# Altium project FPGA_DB.PrjPcb
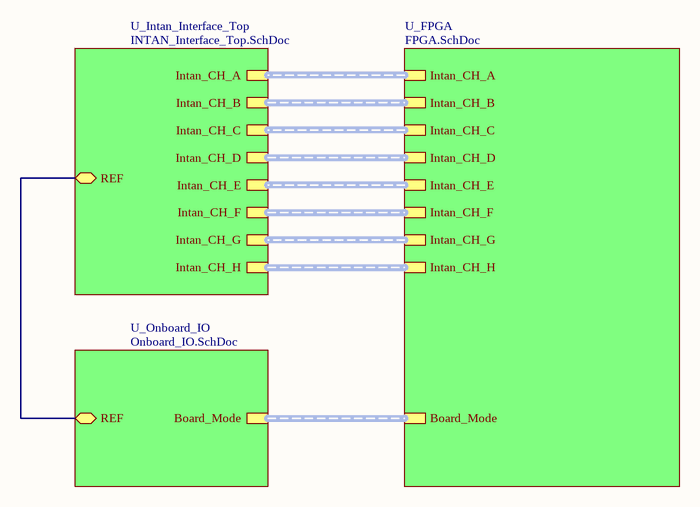
[diagram p0: Title_Page.SchDoc]
Project_Date: 2026-09-01; Project_DateCode: DC260901; Project_Designer1: Olivier Bergeron; Project_Designer2: Quentin Mascret; Project_Designer3: Benoit Gosselin; Project_Global: UHDEMG; Project_Group: SBioML; Project_Name: FPGA Daughter Board; Project_Revision: 2.000; Project_Stencil_Bot_Thickness: 0.1 MM; Project_Stencil_Top_Thickness: 0.1 MM
5 sheets, 140 parts. Net scope: hierarchical (ports join the sheet entries above them; power ports are global).
Board file: FPGA_DB.PcbDoc
Sheets:
  Title_Page.SchDoc
    U_FPGA = FPGA.SchDoc
    U_Onboard_IO = Onboard_IO.SchDoc
    U_Intan_Interface_Top = INTAN_Interface_Top.SchDoc
      A = INTAN_Interface.SchDoc
      B = INTAN_Interface.SchDoc
      C = INTAN_Interface.SchDoc
      D = INTAN_Interface.SchDoc
      E = INTAN_Interface.SchDoc
      F = INTAN_Interface.SchDoc
      G = INTAN_Interface.SchDoc
      H = INTAN_Interface.SchDoc

## Sheet Title_Page.SchDoc
size Tabloid; SheetNumber: 1; SheetTotal: 5; Sheet_Name: Title Page; Size: 11x17

### Sub-sheets
U_FPGA = FPGA.SchDoc: Board_Mode (harness Board_Mode), Intan_CH_A (harness Intan_CH), Intan_CH_B (harness Intan_CH), Intan_CH_C (harness Intan_CH), Intan_CH_D (harness Intan_CH), Intan_CH_E (harness Intan_CH), Intan_CH_F (harness Intan_CH), Intan_CH_G (harness Intan_CH), Intan_CH_H (harness Intan_CH)
U_Intan_Interface_Top = INTAN_Interface_Top.SchDoc: Intan_CH_A (harness Intan_CH), Intan_CH_B (harness Intan_CH), Intan_CH_C (harness Intan_CH), Intan_CH_D (harness Intan_CH), Intan_CH_E (harness Intan_CH), Intan_CH_F (harness Intan_CH), Intan_CH_G (harness Intan_CH), Intan_CH_H (harness Intan_CH), REF (bidir)
U_Onboard_IO = Onboard_IO.SchDoc: Board_Mode (harness Board_Mode), REF (bidir)

### Nets
REF: sheet U_Onboard_IO/REF, sheet U_Intan_Interface_Top/REF

### Buses and harness runs
harness sheet U_FPGA/Board_Mode = sheet U_Onboard_IO/Board_Mode
harness sheet U_FPGA/Intan_CH_A = sheet U_Intan_Interface_Top/Intan_CH_A
harness sheet U_FPGA/Intan_CH_B = sheet U_Intan_Interface_Top/Intan_CH_B
harness sheet U_FPGA/Intan_CH_C = sheet U_Intan_Interface_Top/Intan_CH_C
harness sheet U_FPGA/Intan_CH_D = sheet U_Intan_Interface_Top/Intan_CH_D
harness sheet U_FPGA/Intan_CH_E = sheet U_Intan_Interface_Top/Intan_CH_E
harness sheet U_FPGA/Intan_CH_F = sheet U_Intan_Interface_Top/Intan_CH_F
harness sheet U_FPGA/Intan_CH_G = sheet U_Intan_Interface_Top/Intan_CH_G
harness sheet U_FPGA/Intan_CH_H = sheet U_Intan_Interface_Top/Intan_CH_H

### Notes on the sheet
- Sheet Name
- Project Title
- Global Project
- Size
- Group
- Revision
- Date
- Sheet
- of
- Filename
- Designers

## Sheet FPGA.SchDoc
size Tabloid; SheetNumber: 2; SheetTotal: 5; Sheet_Name: FPGA; Size: 11x17
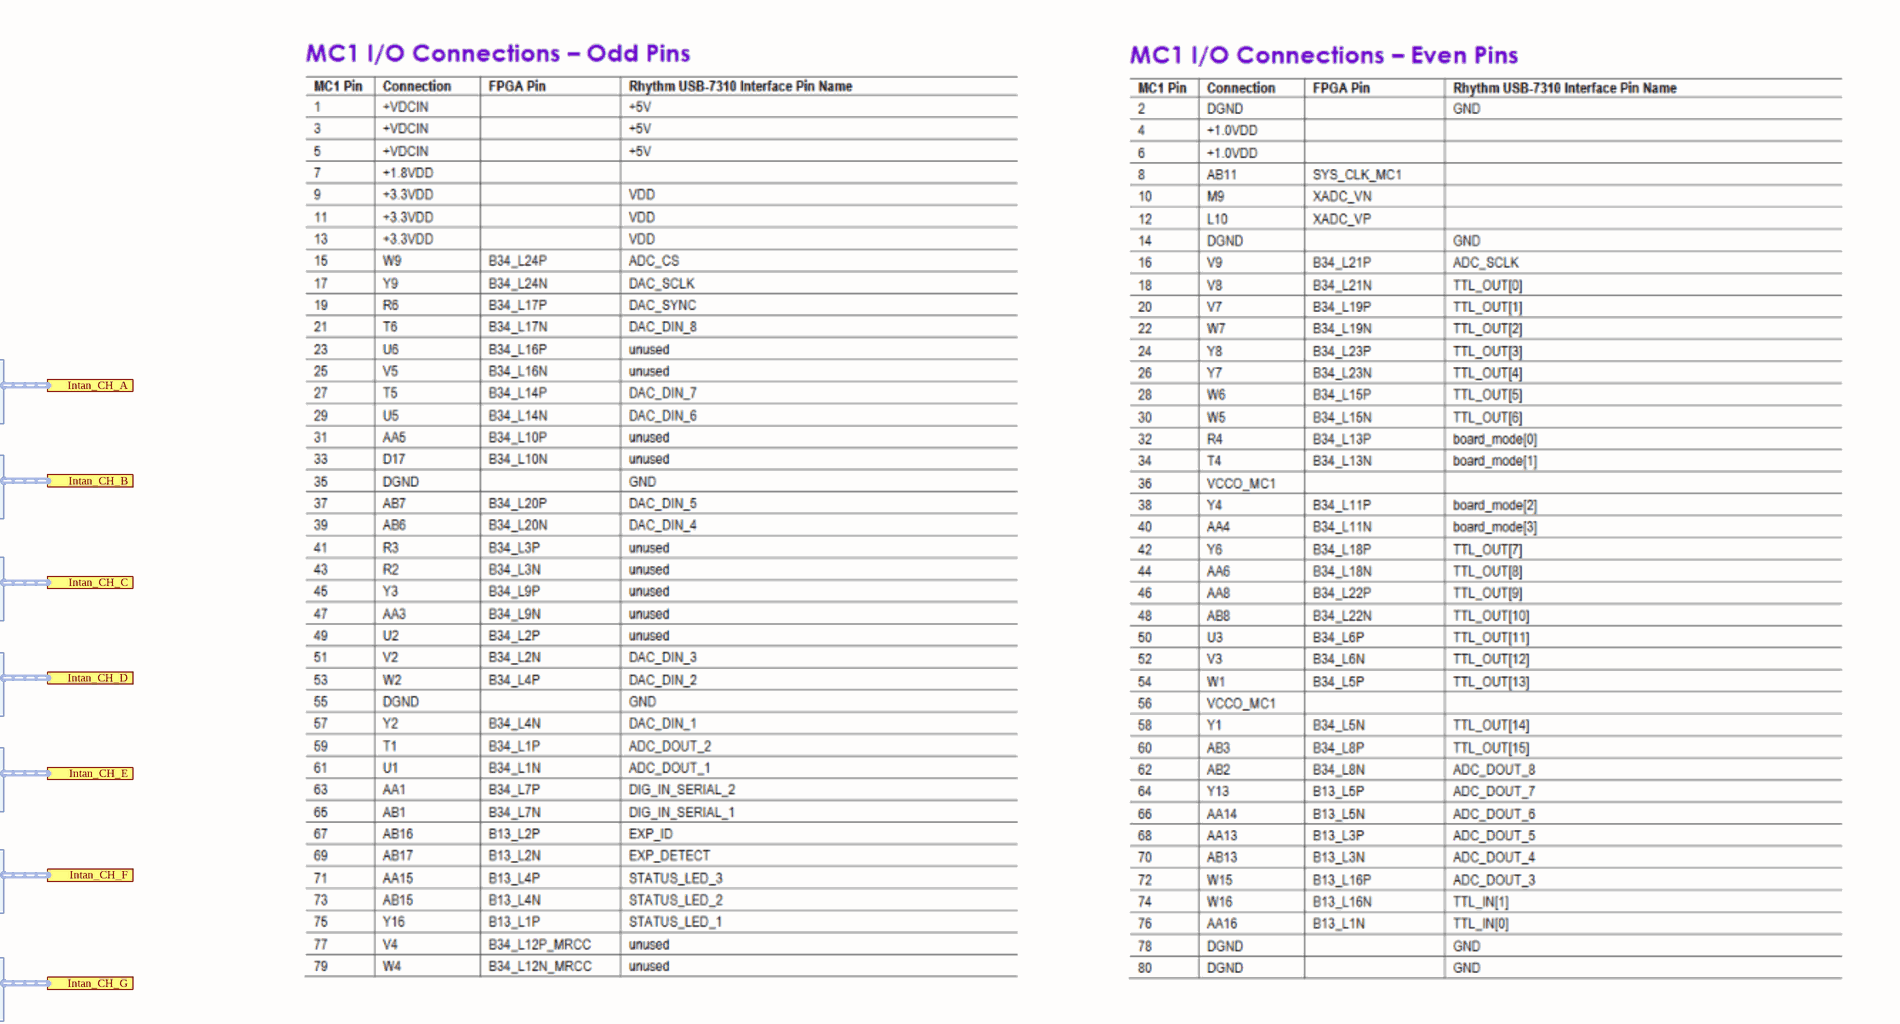
[diagram p1: FPGA.SchDoc, top right]
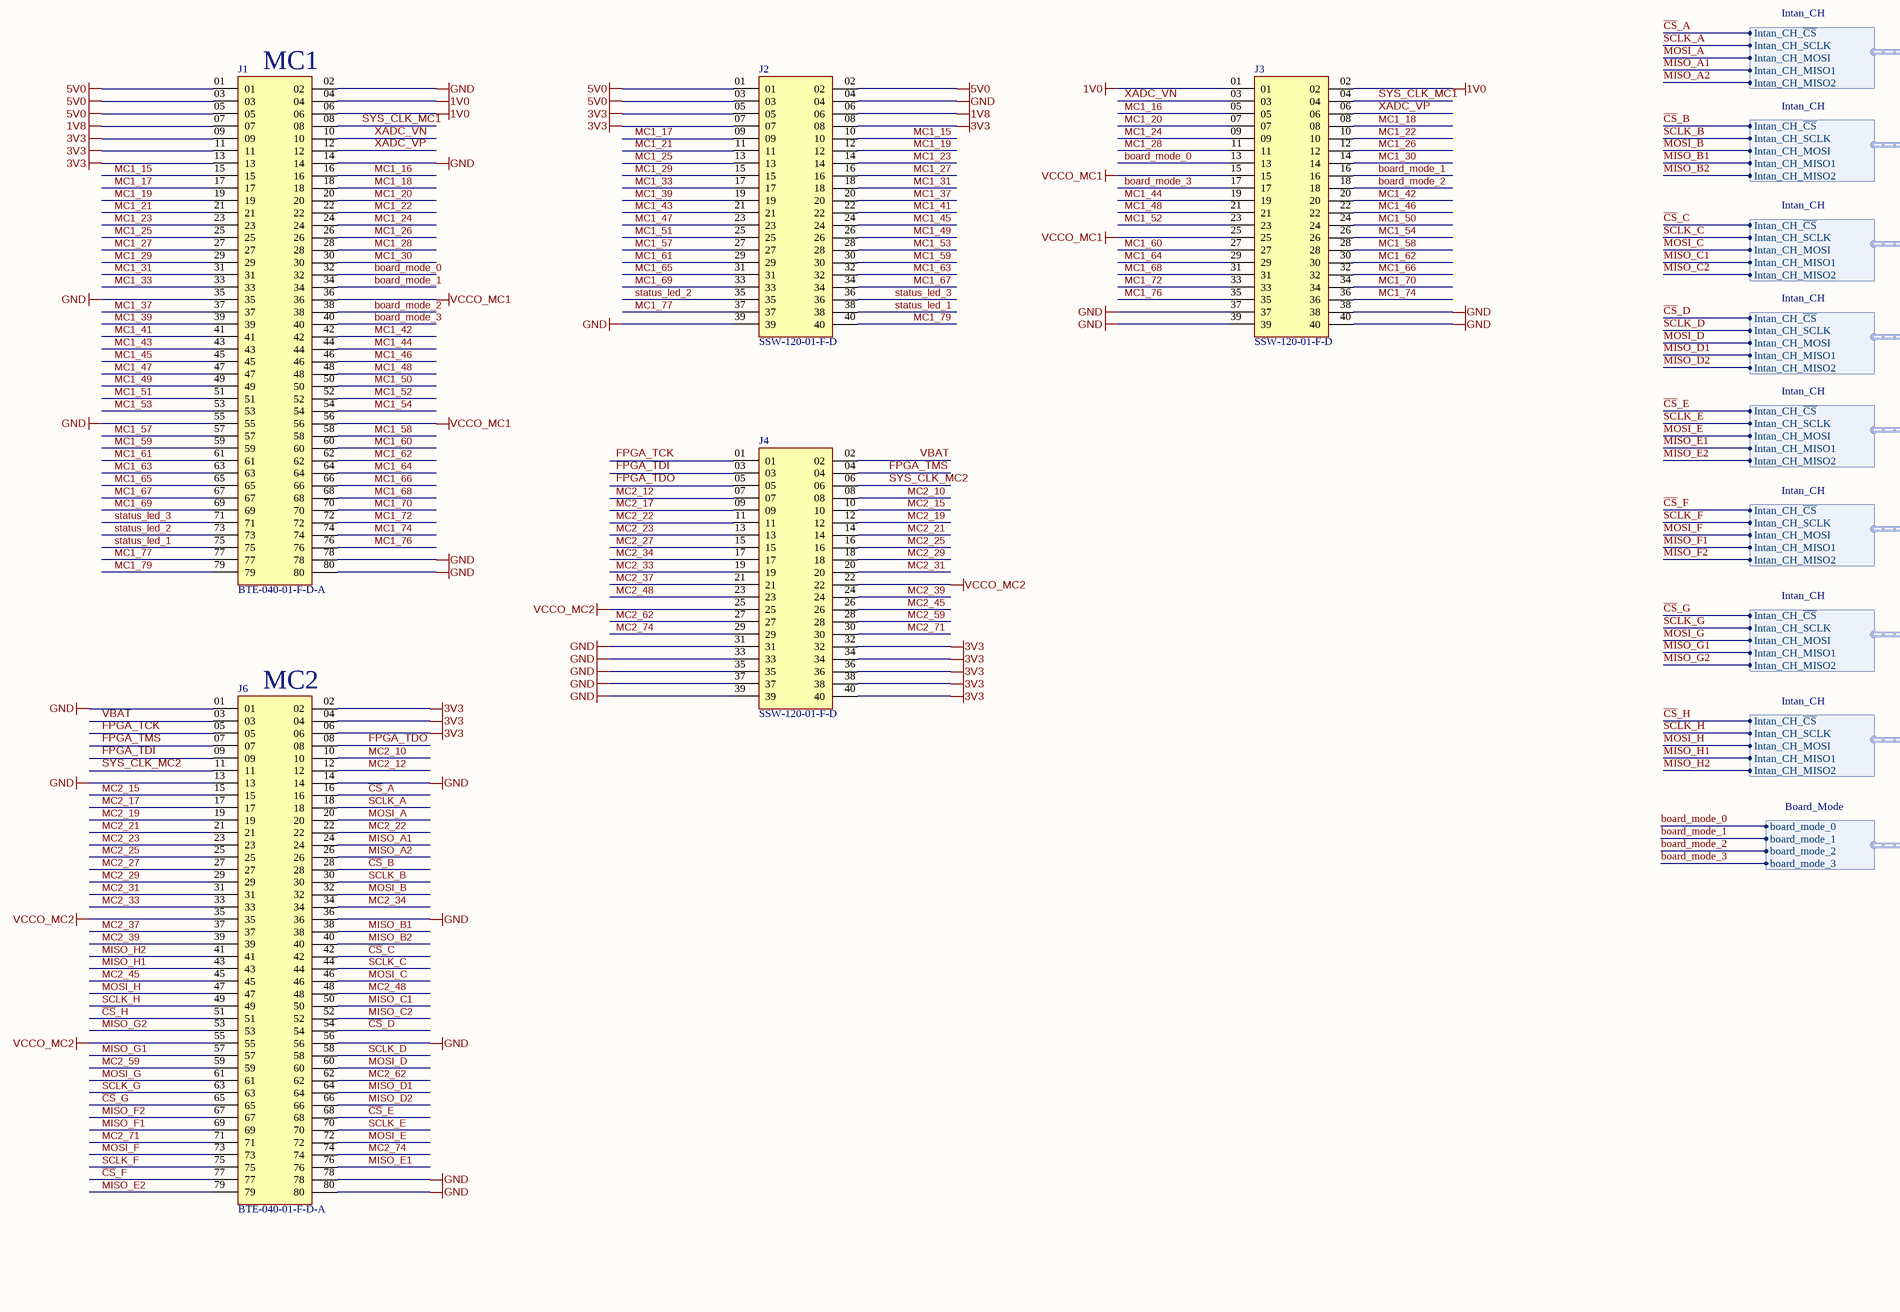
[diagram p2: FPGA.SchDoc, bottom left]
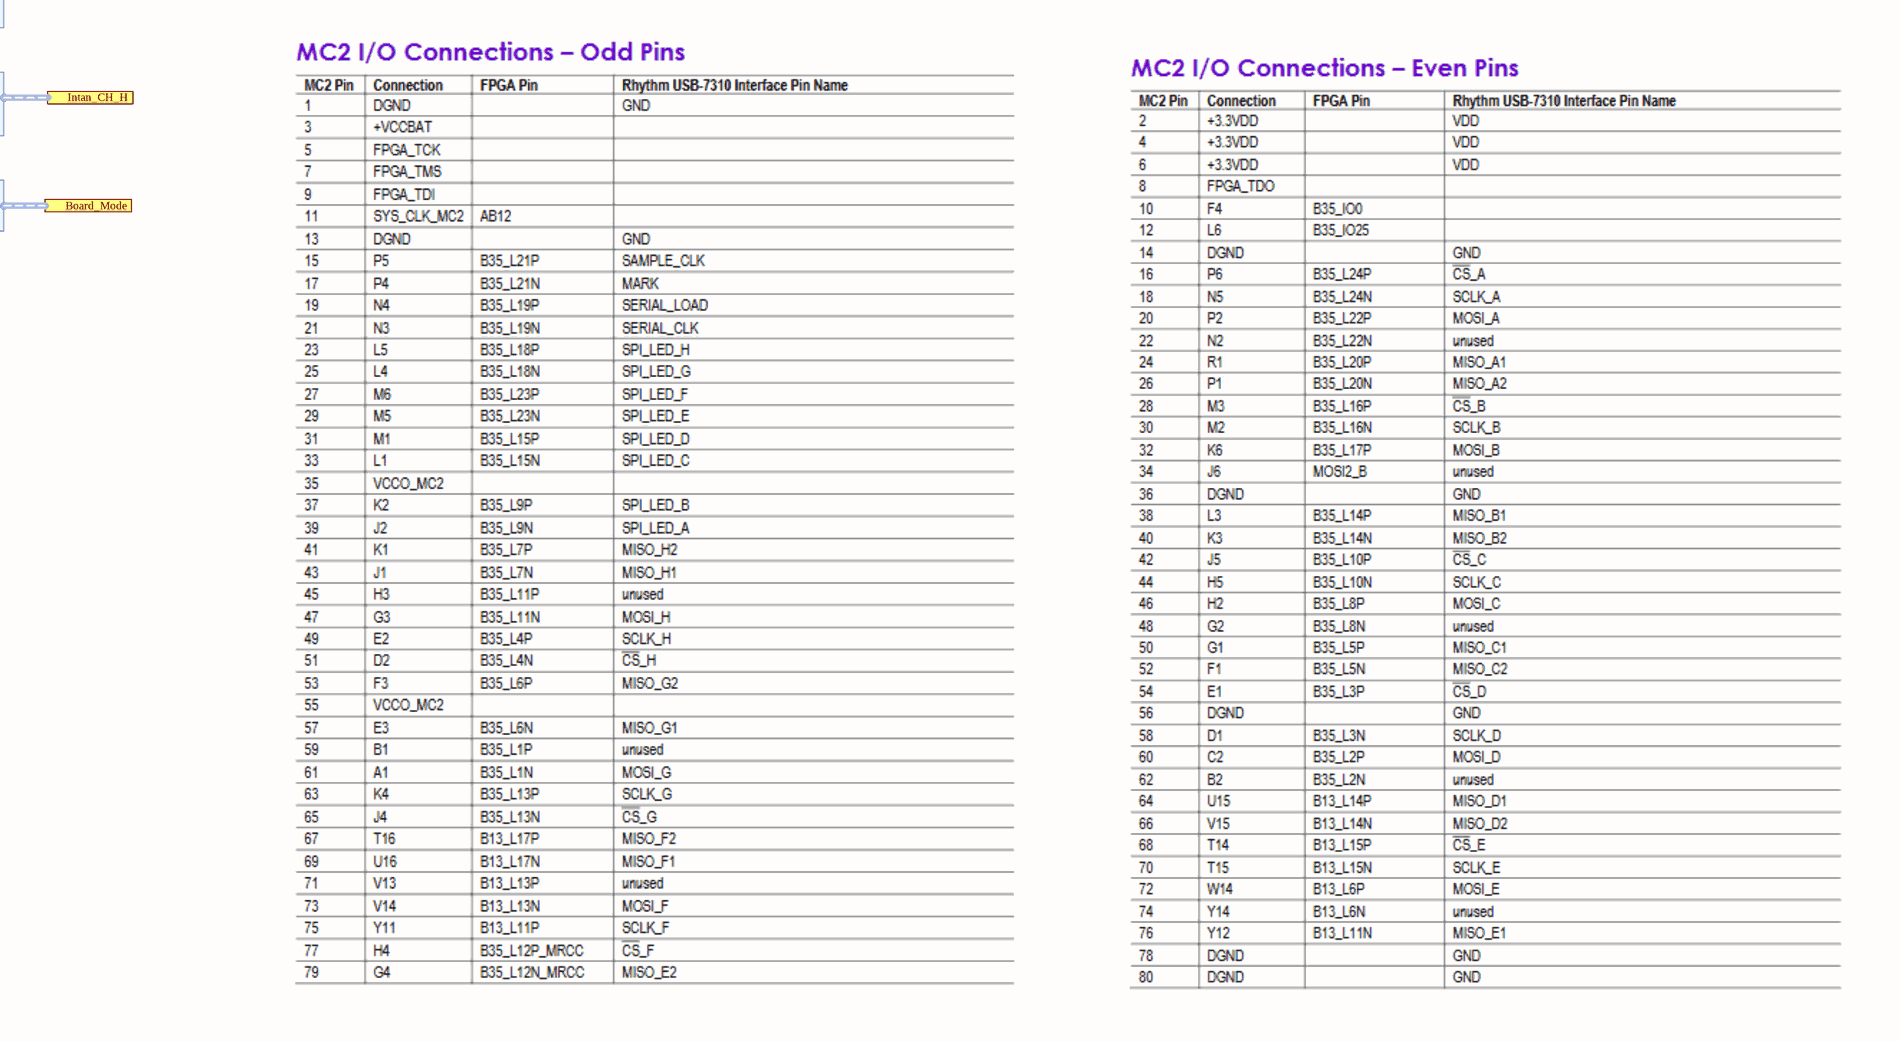
[diagram p3: FPGA.SchDoc, bottom right]

### Parts
J1  BTE-040-01-F-D-A  [SAMTEC_BTE-040-01-F-D-A]
J2  SSW-120-01-F-D  [SAMTEC_SSW-120-01-F-D]
J3  SSW-120-01-F-D  [SAMTEC_SSW-120-01-F-D]
J4  SSW-120-01-F-D  [SAMTEC_SSW-120-01-F-D]
J6  BTE-040-01-F-D-A  [SAMTEC_BTE-040-01-F-D-A]

### Ports
Board_Mode (harness Board_Mode), Intan_CH_A (harness Intan_CH), Intan_CH_B (harness Intan_CH), Intan_CH_C (harness Intan_CH), Intan_CH_D (harness Intan_CH), Intan_CH_E (harness Intan_CH), Intan_CH_F (harness Intan_CH), Intan_CH_G (harness Intan_CH), Intan_CH_H (harness Intan_CH)

### Harnesses
Board_Mode: board_mode_0, board_mode_1, board_mode_2, board_mode_3
Intan_CH: Intan_CH_~{CS}, Intan_CH_SCLK, Intan_CH_MOSI, Intan_CH_MISO1, Intan_CH_MISO2

### Nets
1V0: J1.04 J1.06 J3.01 J3.02
1V8: J1.07 J2.06
3V3: J1.09 J1.11 J1.13 J2.05 J2.07 J2.08 J4.32 J4.34 J4.36 J4.38 J4.40 J6.02 J6.04 J6.06
5V0: J1.01 J1.03 J1.05 J2.01 J2.02 J2.03
GND: J1.02 J1.14 J1.35 J1.55 J1.78 J1.80 J2.04 J2.39 J3.37 J3.38 J3.39 J3.40 J4.31 J4.33 J4.35 J4.37 J4.39 J6.01 J6.13 J6.14 J6.36 J6.56 J6.78 J6.80
VCCO_MC1: J1.36 J1.56 J3.15 J3.25
VCCO_MC2: J4.22 J4.25 J6.35 J6.55
board_mode_0: J1.32 J3.13 ; port Board_Mode.board_mode_0
board_mode_1: J1.34 J3.16 ; port Board_Mode.board_mode_1
board_mode_2: J1.38 J3.18 ; port Board_Mode.board_mode_2
board_mode_3: J1.40 J3.17 ; port Board_Mode.board_mode_3
~{CS}_A: J6.16 ; port Intan_CH_A.Intan_CH_~{CS}
~{CS}_B: J6.28 ; port Intan_CH_B.Intan_CH_~{CS}
~{CS}_C: J6.42 ; port Intan_CH_C.Intan_CH_~{CS}
~{CS}_D: J6.54 ; port Intan_CH_D.Intan_CH_~{CS}
~{CS}_E: J6.68 ; port Intan_CH_E.Intan_CH_~{CS}
~{CS}_F: J6.77 ; port Intan_CH_F.Intan_CH_~{CS}
~{CS}_G: J6.65 ; port Intan_CH_G.Intan_CH_~{CS}
~{CS}_H: J6.51 ; port Intan_CH_H.Intan_CH_~{CS}
FPGA_TCK: J4.01 J6.05
FPGA_TDI: J4.03 J6.09
FPGA_TDO: J4.05 J6.08
FPGA_TMS: J4.04 J6.07
MC1_15: J1.15 J2.10
MC1_16: J1.16 J3.05
MC1_17: J1.17 J2.09
MC1_18: J1.18 J3.08
MC1_19: J1.19 J2.12
MC1_20: J1.20 J3.07
MC1_21: J1.21 J2.11
MC1_22: J1.22 J3.10
MC1_23: J1.23 J2.14
MC1_24: J1.24 J3.09
MC1_25: J1.25 J2.13
MC1_26: J1.26 J3.12
MC1_27: J1.27 J2.16
MC1_28: J1.28 J3.11
MC1_29: J1.29 J2.15
MC1_30: J1.30 J3.14
MC1_31: J1.31 J2.18
MC1_33: J1.33 J2.17
MC1_37: J1.37 J2.20
MC1_39: J1.39 J2.19
MC1_41: J1.41 J2.22
MC1_42: J1.42 J3.20
MC1_43: J1.43 J2.21
MC1_44: J1.44 J3.19
MC1_45: J1.45 J2.24
MC1_46: J1.46 J3.22
MC1_47: J1.47 J2.23
MC1_48: J1.48 J3.21
MC1_49: J1.49 J2.26
MC1_50: J1.50 J3.24
MC1_51: J1.51 J2.25
MC1_52: J1.52 J3.23
MC1_53: J1.53 J2.28
MC1_54: J1.54 J3.26
MC1_57: J1.57 J2.27
MC1_58: J1.58 J3.28
MC1_59: J1.59 J2.30
MC1_60: J1.60 J3.27
MC1_61: J1.61 J2.29
MC1_62: J1.62 J3.30
MC1_63: J1.63 J2.32
MC1_64: J1.64 J3.29
MC1_65: J1.65 J2.31
MC1_66: J1.66 J3.32
MC1_67: J1.67 J2.34
MC1_68: J1.68 J3.31
MC1_69: J1.69 J2.33
MC1_70: J1.70 J3.34
MC1_72: J1.72 J3.33
MC1_74: J1.74 J3.36
MC1_76: J1.76 J3.35
MC1_77: J1.77 J2.37
MC1_79: J1.79 J2.40
MC2_10: J4.08 J6.10
MC2_12: J4.07 J6.12
MC2_15: J4.10 J6.15
MC2_17: J4.09 J6.17
MC2_19: J4.12 J6.19
MC2_21: J4.14 J6.21
MC2_22: J4.11 J6.22
MC2_23: J4.13 J6.23
MC2_25: J4.16 J6.25
MC2_27: J4.15 J6.27
MC2_29: J4.18 J6.29
MC2_31: J4.20 J6.31
MC2_33: J4.19 J6.33
MC2_34: J4.17 J6.34
MC2_37: J4.21 J6.37
MC2_39: J4.24 J6.39
MC2_45: J4.26 J6.45
MC2_48: J4.23 J6.48
MC2_59: J4.28 J6.59
MC2_62: J4.27 J6.62
MC2_71: J4.30 J6.71
MC2_74: J4.29 J6.74
MISO_A1: J6.24 ; port Intan_CH_A.Intan_CH_MISO1
MISO_A2: J6.26 ; port Intan_CH_A.Intan_CH_MISO2
MISO_B1: J6.38 ; port Intan_CH_B.Intan_CH_MISO1
MISO_B2: J6.40 ; port Intan_CH_B.Intan_CH_MISO2
MISO_C1: J6.50 ; port Intan_CH_C.Intan_CH_MISO1
MISO_C2: J6.52 ; port Intan_CH_C.Intan_CH_MISO2
MISO_D1: J6.64 ; port Intan_CH_D.Intan_CH_MISO1
MISO_D2: J6.66 ; port Intan_CH_D.Intan_CH_MISO2
MISO_E1: J6.76 ; port Intan_CH_E.Intan_CH_MISO1
MISO_E2: J6.79 ; port Intan_CH_E.Intan_CH_MISO2
MISO_F1: J6.69 ; port Intan_CH_F.Intan_CH_MISO1
MISO_F2: J6.67 ; port Intan_CH_F.Intan_CH_MISO2
MISO_G1: J6.57 ; port Intan_CH_G.Intan_CH_MISO1
MISO_G2: J6.53 ; port Intan_CH_G.Intan_CH_MISO2
MISO_H1: J6.43 ; port Intan_CH_H.Intan_CH_MISO1
MISO_H2: J6.41 ; port Intan_CH_H.Intan_CH_MISO2
MOSI_A: J6.20 ; port Intan_CH_A.Intan_CH_MOSI
MOSI_B: J6.32 ; port Intan_CH_B.Intan_CH_MOSI
MOSI_C: J6.46 ; port Intan_CH_C.Intan_CH_MOSI
MOSI_D: J6.60 ; port Intan_CH_D.Intan_CH_MOSI
MOSI_E: J6.72 ; port Intan_CH_E.Intan_CH_MOSI
MOSI_F: J6.73 ; port Intan_CH_F.Intan_CH_MOSI
MOSI_G: J6.61 ; port Intan_CH_G.Intan_CH_MOSI
MOSI_H: J6.47 ; port Intan_CH_H.Intan_CH_MOSI
SCLK_A: J6.18 ; port Intan_CH_A.Intan_CH_SCLK
SCLK_B: J6.30 ; port Intan_CH_B.Intan_CH_SCLK
SCLK_C: J6.44 ; port Intan_CH_C.Intan_CH_SCLK
SCLK_D: J6.58 ; port Intan_CH_D.Intan_CH_SCLK
SCLK_E: J6.70 ; port Intan_CH_E.Intan_CH_SCLK
SCLK_F: J6.75 ; port Intan_CH_F.Intan_CH_SCLK
SCLK_G: J6.63 ; port Intan_CH_G.Intan_CH_SCLK
SCLK_H: J6.49 ; port Intan_CH_H.Intan_CH_SCLK
status_led_1: J1.75 J2.38
status_led_2: J1.73 J2.35
status_led_3: J1.71 J2.36
SYS_CLK_MC1: J1.08 J3.04
SYS_CLK_MC2: J4.06 J6.11
VBAT: J4.02 J6.03
XADC_VN: J1.10 J3.03
XADC_VP: J1.12 J3.06

### Notes on the sheet
- (near J1) MC1
- (near J6) MC2
- Sheet Name
- Project Title
- Global Project
- Size
- Group
- Revision
- Date
- Sheet
- of
- Filename
- Designers

### Library data of the parts
J1 J6 = CON_FPGA_SMD: 80 Position Connector Header, Outer Shroud Contacts Surface Mount Gold; MF: Samtec; MP: BTE-040-01-F-D-A; Value: *; Package: None; Price: None; Availability: Unavailable
J2-J4 = CON_HEADF_2X20: 40 Position Receptacle Connector 0.100" (2.54mm) Through Hole Gold; MF: Samtec; Package: None; Availability: Unavailable; Value: *; MP: SSW-120-01-F-D; Price: None

## Sheet Onboard_IO.SchDoc
size Tabloid; SheetNumber: 3; SheetTotal: 5; Sheet_Name: Onboard IO; Size: 11x17
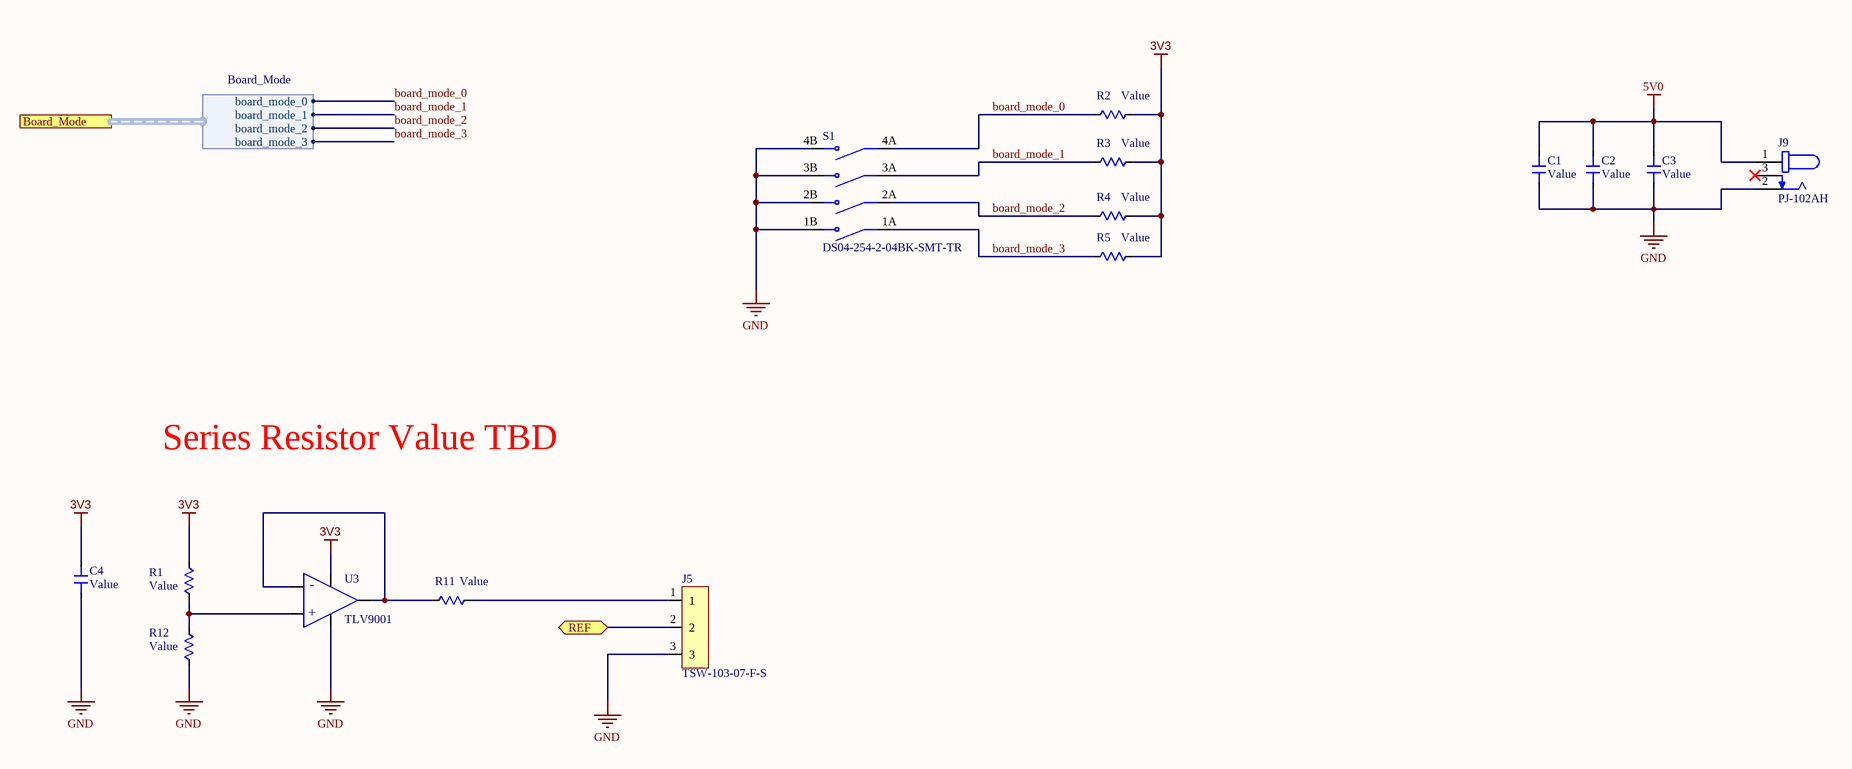
[diagram p4: Onboard_IO.SchDoc]

### Parts
C1  Value  [0805_CAPACITOR]
C2  Value  [0603_CAPACITOR]
C3  Value  [0603_CAPACITOR]
C4  Value  [0603_CAPACITOR]
J5  TSW-103-07-F-S  [SMTC-TSW-103-07-X-S]
J9  PJ-102AH  [CUI_PJ-102AH]
R1  Value  [0603_RESISTOR]
R2  Value  [0603_RESISTOR]
R3  Value  [0603_RESISTOR]
R4  Value  [0603_RESISTOR]
R5  Value  [0603_RESISTOR]
R11  Value  [0603_RESISTOR]
R12  Value  [0603_RESISTOR]
S1  DS04-254-2-04BK-SMT-TR  [SW_DS04-254-2-04BK-SMT-TR]
U3  TLV9001  [SOT-353]

### Ports
Board_Mode (harness Board_Mode), REF (bidir)

### Harnesses
Board_Mode: board_mode_0, board_mode_1, board_mode_2, board_mode_3

### Nets
3V3: C4.2 R1.1 R2.2 R3.2 R4.2 R5.2 U3.5(V+)
5V0: C1.2 C2.2 C3.2 J9.1
GND: C1.1 C2.1 C3.1 C4.1 J5.3 J9.2 R12.2 S1.1B(NO1) S1.2B(NO2) S1.3B(NO3) S1.4B(NO4) U3.2(V-)
board_mode_0: R2.1 S1.4A(COM4) ; port Board_Mode.board_mode_0
board_mode_1: R3.1 S1.3A(COM3) ; port Board_Mode.board_mode_1
board_mode_2: R4.1 S1.2A(COM2) ; port Board_Mode.board_mode_2
board_mode_3: R5.1 S1.1A(COM1) ; port Board_Mode.board_mode_3
REF: J5.2 ; port REF
NetJ5_1: J5.1 R11.2
NetR1_2: R1.2 R12.1 U3.3(IN+)
NetR11_1: R11.1 U3.1(Out) U3.4(IN-)

Not connected (* = marked no-connect by the designer): J9 3*

### Notes on the sheet
- Series Resistor Value TBD
- Sheet Name
- Project Title
- Global Project
- Size
- Group
- Revision
- Date
- Sheet
- of
- Filename
- Designers
- (in symbol IC_OP_AMP_1CH) -; +

### Library data of the parts
C1-C4 = Capacitor
J5 = CON_HEADER_1X3: 0.025" SQ Post Header, Through-hole, Vertical, -55 to 125 degC, 2.54 mm Pitch, 3-Pin, Male, RoHS
J9 = CON_PWR_24V_5A: Power Barrel Connector Jack 2.00mm ID (0.079"), 5.50mm OD (0.217") Through Hole, Right Angle; MF: Same Sky; SnapEDA_Link: https://www.snapeda.com/parts/PJ-102AH/Same+Sky/view-part/?ref=snap; Package: None; Value: *; MP: PJ-102AH; Check_prices: https://www.snapeda.com/parts/PJ-102AH/Same+Sky/view-part/?ref=eda
R1-R5 R11 R12 = Resistor: GRAMS Lib Spec: 2.7
S1 = SW_DIP_4_SMT: Dip Switch SPST 4 Position Surface Mount Slide (Standard) Actuator 25mA 24VDC; MF: Same Sky; SnapEDA_Link: https://www.snapeda.com/parts/DS04-254-2-04BK-SMT-TR/Same+Sky/view-part/?ref=snap; Package: None; Value: *; MP: DS04-254-2-04BK-SMT-TR; Check_prices: https://www.snapeda.com/parts/DS04-254-2-04BK-SMT-TR/Same+Sky/view-part/?ref=eda
U3 = IC_OP_AMP_1CH: CMOS Amplifier 1 Circuit Rail-to-Rail SC-70-5 / 1.8V - 5.5V

## Sheet INTAN_Interface_Top.SchDoc
size Tabloid; SheetNumber: 4; SheetTotal: 5; Sheet_Name: INTAN Interface - Top; Size: 11x17
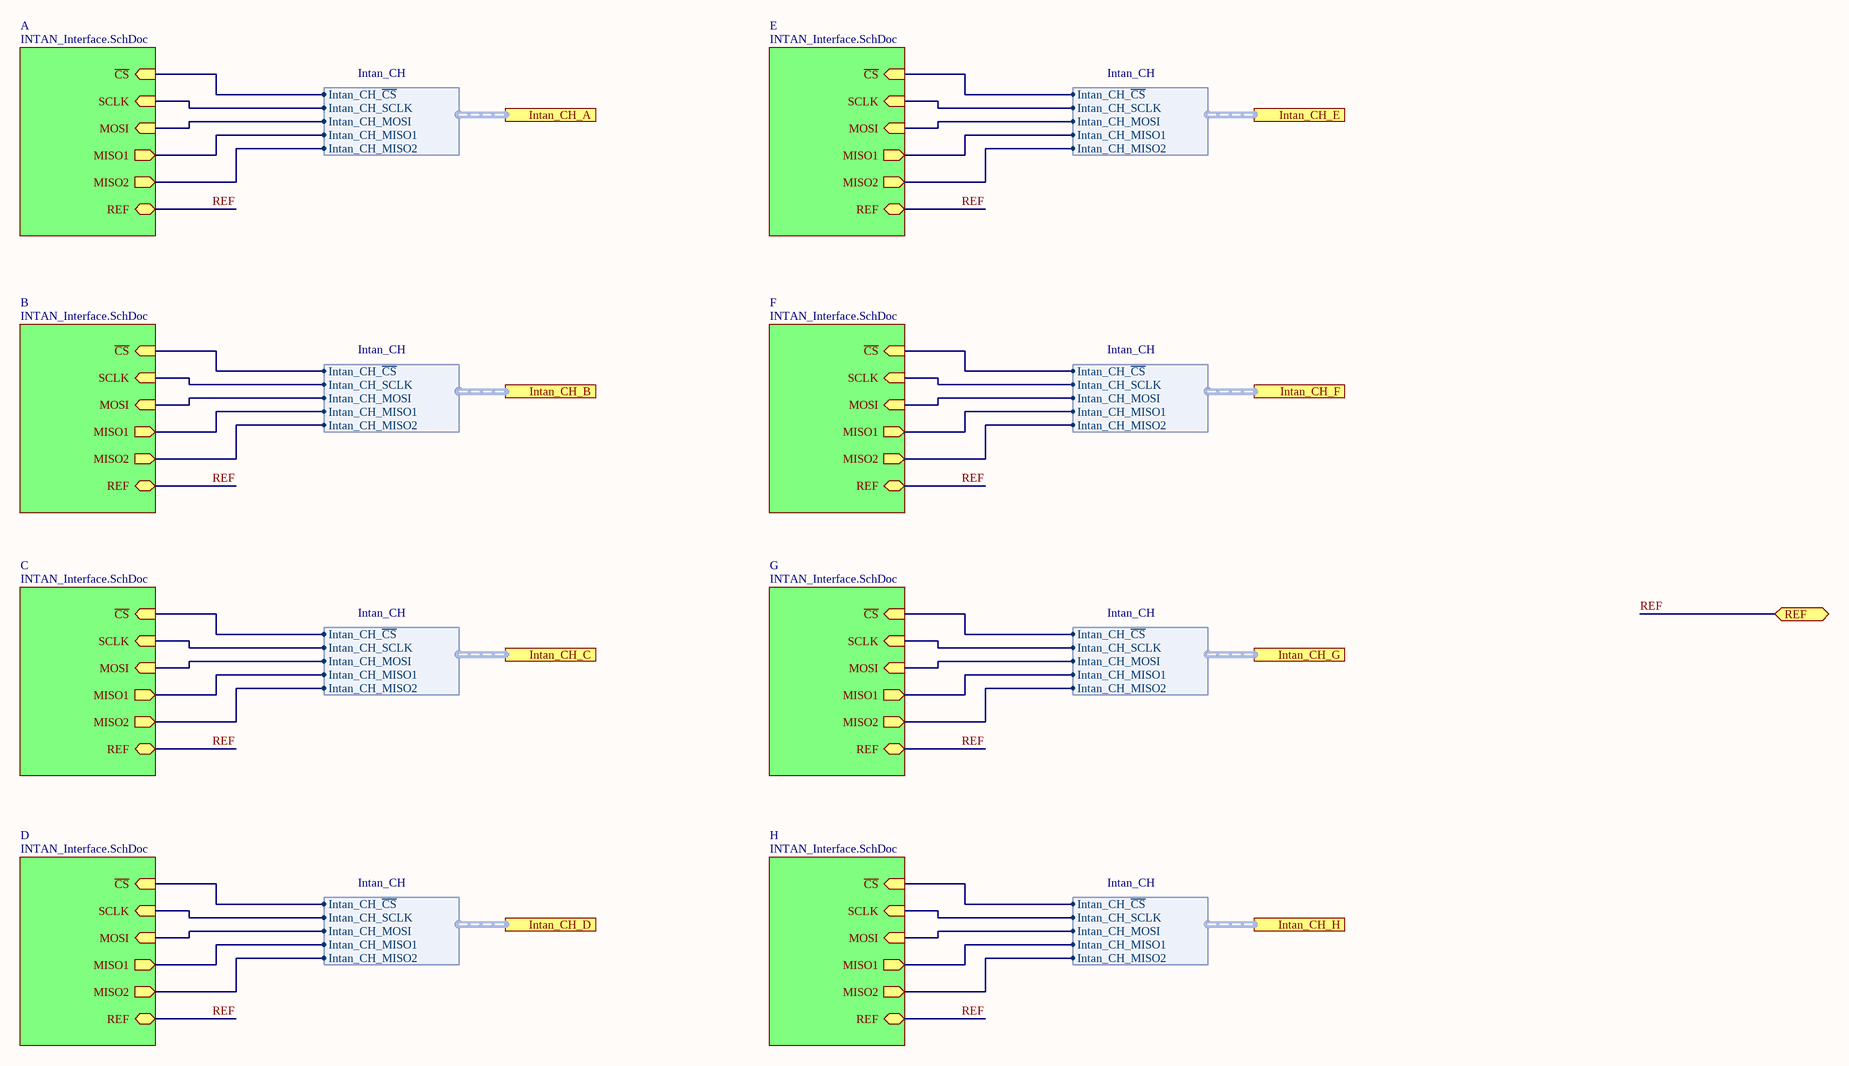
[diagram p5: INTAN_Interface_Top.SchDoc]

### Sub-sheets
A = INTAN_Interface.SchDoc: ~{CS} (in), SCLK (in), MOSI (in), MISO1 (out), MISO2 (out), REF (bidir)
B = INTAN_Interface.SchDoc: ~{CS} (in), SCLK (in), MOSI (in), MISO1 (out), MISO2 (out), REF (bidir)
C = INTAN_Interface.SchDoc: ~{CS} (in), SCLK (in), MOSI (in), MISO1 (out), MISO2 (out), REF (bidir)
D = INTAN_Interface.SchDoc: ~{CS} (in), SCLK (in), MOSI (in), MISO1 (out), MISO2 (out), REF (bidir)
E = INTAN_Interface.SchDoc: ~{CS} (in), SCLK (in), MOSI (in), MISO1 (out), MISO2 (out), REF (bidir)
F = INTAN_Interface.SchDoc: ~{CS} (in), SCLK (in), MOSI (in), MISO1 (out), MISO2 (out), REF (bidir)
G = INTAN_Interface.SchDoc: ~{CS} (in), SCLK (in), MOSI (in), MISO1 (out), MISO2 (out), REF (bidir)
H = INTAN_Interface.SchDoc: ~{CS} (in), SCLK (in), MOSI (in), MISO1 (out), MISO2 (out), REF (bidir)

### Ports
Intan_CH_A (harness Intan_CH), Intan_CH_B (harness Intan_CH), Intan_CH_C (harness Intan_CH), Intan_CH_D (harness Intan_CH), Intan_CH_E (harness Intan_CH), Intan_CH_F (harness Intan_CH), Intan_CH_G (harness Intan_CH), Intan_CH_H (harness Intan_CH), REF (bidir)

### Harnesses
Intan_CH: Intan_CH_~{CS}, Intan_CH_SCLK, Intan_CH_MOSI, Intan_CH_MISO1, Intan_CH_MISO2

### Nets
~{CS}_A: sheet A/~{CS}, port Intan_CH_A.Intan_CH_~{CS}
~{CS}_B: sheet B/~{CS}, port Intan_CH_B.Intan_CH_~{CS}
~{CS}_C: sheet C/~{CS}, port Intan_CH_C.Intan_CH_~{CS}
~{CS}_D: sheet D/~{CS}, port Intan_CH_D.Intan_CH_~{CS}
~{CS}_E: sheet E/~{CS}, port Intan_CH_E.Intan_CH_~{CS}
~{CS}_F: sheet F/~{CS}, port Intan_CH_F.Intan_CH_~{CS}
~{CS}_G: sheet G/~{CS}, port Intan_CH_G.Intan_CH_~{CS}
~{CS}_H: sheet H/~{CS}, port Intan_CH_H.Intan_CH_~{CS}
MISO_A1: sheet A/MISO1, port Intan_CH_A.Intan_CH_MISO1
MISO_A2: sheet A/MISO2, port Intan_CH_A.Intan_CH_MISO2
MISO_B1: sheet B/MISO1, port Intan_CH_B.Intan_CH_MISO1
MISO_B2: sheet B/MISO2, port Intan_CH_B.Intan_CH_MISO2
MISO_C1: sheet C/MISO1, port Intan_CH_C.Intan_CH_MISO1
MISO_C2: sheet C/MISO2, port Intan_CH_C.Intan_CH_MISO2
MISO_D1: sheet D/MISO1, port Intan_CH_D.Intan_CH_MISO1
MISO_D2: sheet D/MISO2, port Intan_CH_D.Intan_CH_MISO2
MISO_E1: sheet E/MISO1, port Intan_CH_E.Intan_CH_MISO1
MISO_E2: sheet E/MISO2, port Intan_CH_E.Intan_CH_MISO2
MISO_F1: sheet F/MISO1, port Intan_CH_F.Intan_CH_MISO1
MISO_F2: sheet F/MISO2, port Intan_CH_F.Intan_CH_MISO2
MISO_G1: sheet G/MISO1, port Intan_CH_G.Intan_CH_MISO1
MISO_G2: sheet G/MISO2, port Intan_CH_G.Intan_CH_MISO2
MISO_H1: sheet H/MISO1, port Intan_CH_H.Intan_CH_MISO1
MISO_H2: sheet H/MISO2, port Intan_CH_H.Intan_CH_MISO2
MOSI_A: sheet A/MOSI, port Intan_CH_A.Intan_CH_MOSI
MOSI_B: sheet B/MOSI, port Intan_CH_B.Intan_CH_MOSI
MOSI_C: sheet C/MOSI, port Intan_CH_C.Intan_CH_MOSI
MOSI_D: sheet D/MOSI, port Intan_CH_D.Intan_CH_MOSI
MOSI_E: sheet E/MOSI, port Intan_CH_E.Intan_CH_MOSI
MOSI_F: sheet F/MOSI, port Intan_CH_F.Intan_CH_MOSI
MOSI_G: sheet G/MOSI, port Intan_CH_G.Intan_CH_MOSI
MOSI_H: sheet H/MOSI, port Intan_CH_H.Intan_CH_MOSI
REF: port REF, sheet A/REF, sheet B/REF, sheet C/REF, sheet D/REF, sheet E/REF, sheet F/REF, sheet G/REF, sheet H/REF
SCLK_A: sheet A/SCLK, port Intan_CH_A.Intan_CH_SCLK
SCLK_B: sheet B/SCLK, port Intan_CH_B.Intan_CH_SCLK
SCLK_C: sheet C/SCLK, port Intan_CH_C.Intan_CH_SCLK
SCLK_D: sheet D/SCLK, port Intan_CH_D.Intan_CH_SCLK
SCLK_E: sheet E/SCLK, port Intan_CH_E.Intan_CH_SCLK
SCLK_F: sheet F/SCLK, port Intan_CH_F.Intan_CH_SCLK
SCLK_G: sheet G/SCLK, port Intan_CH_G.Intan_CH_SCLK
SCLK_H: sheet H/SCLK, port Intan_CH_H.Intan_CH_SCLK

### Notes on the sheet
- Sheet Name
- Project Title
- Global Project
- Size
- Group
- Revision
- Date
- Sheet
- of
- Filename
- Designers

## Sheet INTAN_Interface.SchDoc
size Tabloid; SheetNumber: 5; SheetTotal: 5; Sheet_Name: INTAN Interface; Size: 11x17
Used 8 times, as channels U_Intan_Interface_Top/A, U_Intan_Interface_Top/B, U_Intan_Interface_Top/C, U_Intan_Interface_Top/D, U_Intan_Interface_Top/E, U_Intan_Interface_Top/F, U_Intan_Interface_Top/G, U_Intan_Interface_Top/H. Parts and nets are listed once, with the designators drawn on the sheet.
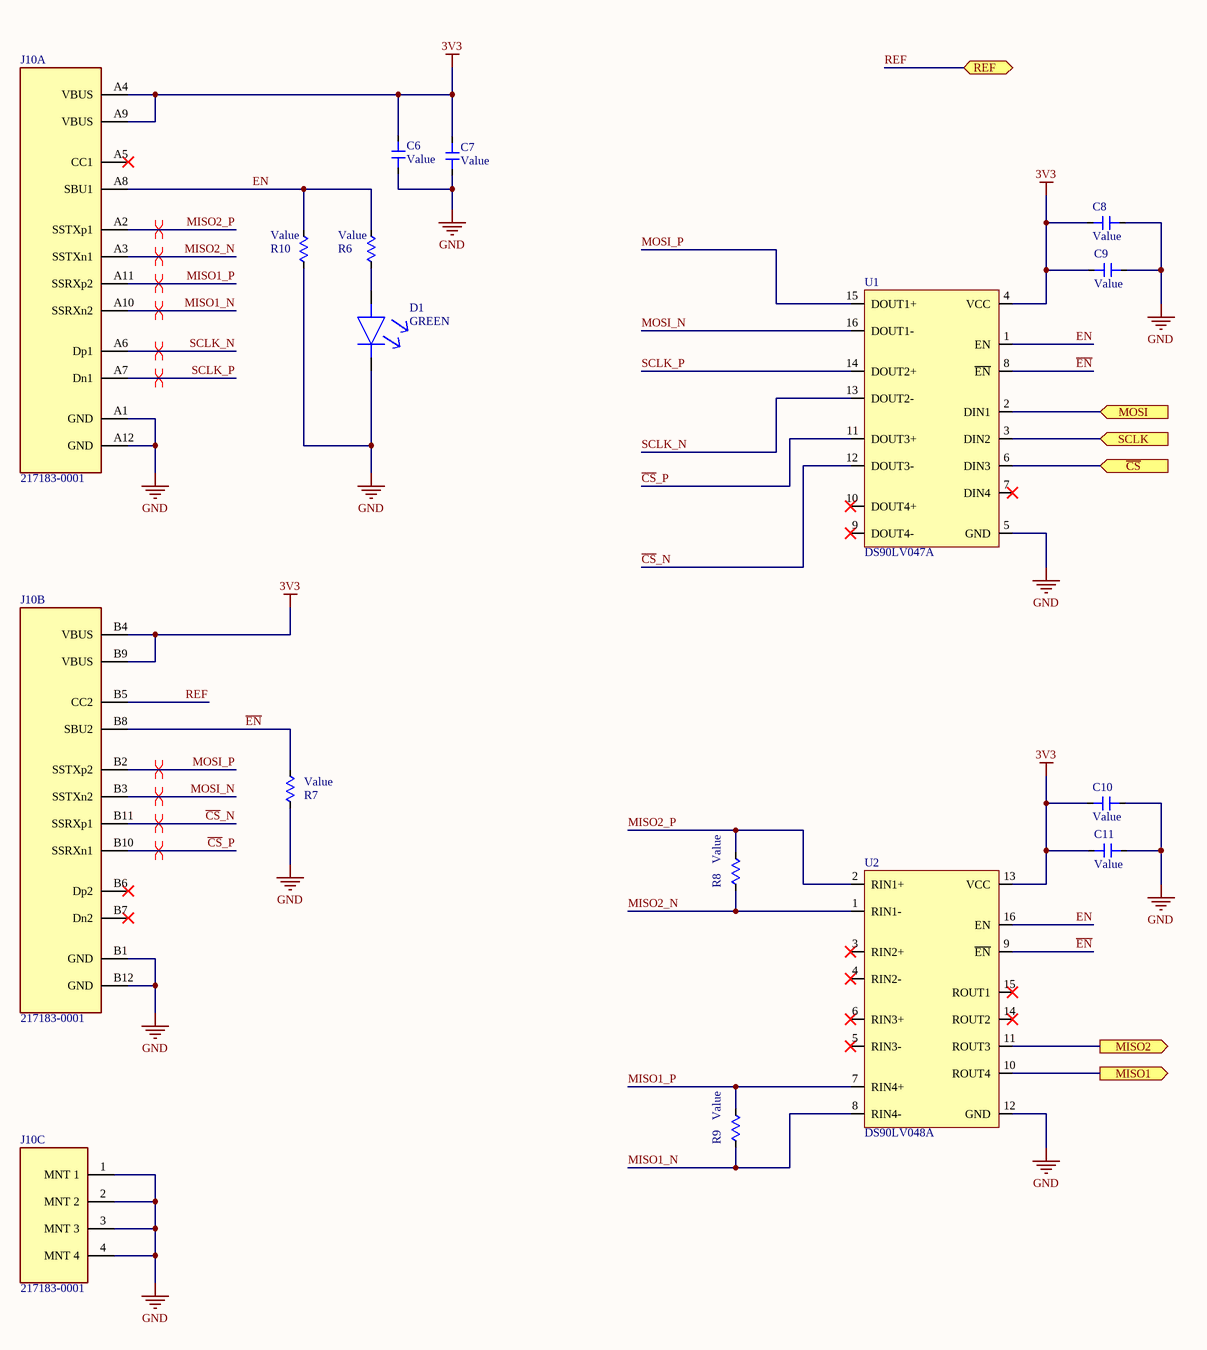
[diagram p6: INTAN_Interface.SchDoc]

### Parts
C6  Value  [0603_CAPACITOR]
C7  Value  [0603_CAPACITOR]
C8  Value  [0603_CAPACITOR]
C9  Value  [0603_CAPACITOR]
C10  Value  [0603_CAPACITOR]
C11  Value  [0603_CAPACITOR]
D1  GREEN  [LED_APT1608LZGCK]
J10  217183-0001  [CON_USB_C_SMD]  (parts A,B,C of 3)
R6  Value  [0603_RESISTOR]
R7  Value  [0603_RESISTOR]
R8  Value  [0402_Resistor]
R9  Value  [0402_Resistor]
R10  Value  [0603_RESISTOR]
U1  DS90LV047A  [TTSOP_16]
U2  DS90LV048A  [TTSOP_16]

### Ports
MISO1 (out), MISO2 (out), MOSI (in), REF (bidir), SCLK (in), ~{CS} (in)

### Nets
3V3: C6.2 C7.2 C8.1 C9.1 C10.1 C11.1 J10.A4(VBUS) J10.A9(VBUS) J10.B4(VBUS) J10.B9(VBUS) U1.4(VCC) U2.13(VCC)
GND: C6.1 C7.1 C8.2 C9.2 C10.2 C11.2 D1.1 J10.1(MNT_1) J10.2(MNT_2) J10.3(MNT_3) J10.4(MNT_4) J10.A1(GND) J10.A12(GND) J10.B1(GND) J10.B12(GND) R7.1 R10.1 U1.5(GND) U2.12(GND)
~{CS}: U1.6(DIN3) ; port ~{CS}
~{CS}_N: J10.B11(SSRXp1) U1.12(DOUT3-)
~{CS}_P: J10.B10(SSRXn1) U1.11(DOUT3+)
~{EN}: J10.B8(SBU2) R7.2 U1.8(~{EN}) U2.9(~{EN})
EN: J10.A8(SBU1) R6.2 R10.2 U1.1(EN) U2.16(EN)
MISO1: U2.10(ROUT4) ; port MISO1
MISO1_N: J10.A10(SSRXn2) R9.1 U2.8(RIN4-)
MISO1_P: J10.A11(SSRXp2) R9.2 U2.7(RIN4+)
MISO2: U2.11(ROUT3) ; port MISO2
MISO2_N: J10.A3(SSTXn1) R8.1 U2.1(RIN1-)
MISO2_P: J10.A2(SSTXp1) R8.2 U2.2(RIN1+)
MOSI: U1.2(DIN1) ; port MOSI
MOSI_N: J10.B3(SSTXn2) U1.16(DOUT1-)
MOSI_P: J10.B2(SSTXp2) U1.15(DOUT1+)
REF: J10.B5(CC2) ; port REF
SCLK: U1.3(DIN2) ; port SCLK
SCLK_N: J10.A6(Dp1) U1.13(DOUT2-)
SCLK_P: J10.A7(Dn1) U1.14(DOUT2+)
NetD1_2: D1.2 R6.1

Not connected (* = marked no-connect by the designer): J10 A5(CC1)* B6(Dp2)* B7(Dn2)*; U1 7(DIN4)* 9(DOUT4-)* 10(DOUT4+)*; U2 3(RIN2+)* 4(RIN2-)* 5(RIN3-)* 6(RIN3+)* 14(ROUT2)* 15(ROUT1)*

### Channels
U_Intan_Interface_Top/A: designators end in _A; ports MISO1=MISO_A1 MISO2=MISO_A2 MOSI=MOSI_A REF=REF SCLK=SCLK_A ~{CS}=~{CS}_A
U_Intan_Interface_Top/B: designators end in _B; ports MISO1=MISO_B1 MISO2=MISO_B2 MOSI=MOSI_B REF=REF SCLK=SCLK_B ~{CS}=~{CS}_B
U_Intan_Interface_Top/C: designators end in _C; ports MISO1=MISO_C1 MISO2=MISO_C2 MOSI=MOSI_C REF=REF SCLK=SCLK_C ~{CS}=~{CS}_C
U_Intan_Interface_Top/D: designators end in _D; ports MISO1=MISO_D1 MISO2=MISO_D2 MOSI=MOSI_D REF=REF SCLK=SCLK_D ~{CS}=~{CS}_D
U_Intan_Interface_Top/E: designators end in _E; ports MISO1=MISO_E1 MISO2=MISO_E2 MOSI=MOSI_E REF=REF SCLK=SCLK_E ~{CS}=~{CS}_E
U_Intan_Interface_Top/F: designators end in _F; ports MISO1=MISO_F1 MISO2=MISO_F2 MOSI=MOSI_F REF=REF SCLK=SCLK_F ~{CS}=~{CS}_F
U_Intan_Interface_Top/G: designators end in _G; ports MISO1=MISO_G1 MISO2=MISO_G2 MOSI=MOSI_G REF=REF SCLK=SCLK_G ~{CS}=~{CS}_G
U_Intan_Interface_Top/H: designators end in _H; ports MISO1=MISO_H1 MISO2=MISO_H2 MOSI=MOSI_H REF=REF SCLK=SCLK_H ~{CS}=~{CS}_H

### Layout directives
differential pair: MISO1_N_A, MISO1_P_A, MISO2_N_A, MISO2_P_A, MOSI_N_A, MOSI_P_A, SCLK_N_A, SCLK_P_A, ~{CS}_N_A, ~{CS}_P_A

### Notes on the sheet
- Sheet Name
- Project Title
- Global Project
- Size
- Group
- Revision
- Date
- Sheet
- of
- Filename
- Designers

### Library data of the parts
C6-C11 = Capacitor
D1 = LED_GREEN: GREEN LED
J10 = CON_USBC_TH_SMT: USB-C (USB TYPE-C) USB 3.2 Gen 1 (USB 3.1 Gen 1, Superspeed (USB 3.0)) Receptacle Connector 24 Position Through Hole, Right Angle
R6-R10 = Resistor: GRAMS Lib Spec: 2.7
U1 = IC_LVDS_TX4: LVDS Transceiver 4 Channels with Enable
U2 = IC_LVDS_RX4: LVDS Receiver 4 Channels with Enable

## Nets that join several sheets
3V3: FPGA (14 pins), Onboard_IO (7 pins), U_Intan_Interface_Top/A (12 pins), U_Intan_Interface_Top/B (12 pins), U_Intan_Interface_Top/C (12 pins), U_Intan_Interface_Top/D (12 pins), U_Intan_Interface_Top/E (12 pins), U_Intan_Interface_Top/F (12 pins), U_Intan_Interface_Top/G (12 pins), U_Intan_Interface_Top/H (12 pins)
5V0: FPGA (6 pins), Onboard_IO (C1.2 C2.2 C3.2 J9.1)
GND: FPGA (24 pins), Onboard_IO (12 pins), U_Intan_Interface_Top/A (19 pins), U_Intan_Interface_Top/B (19 pins), U_Intan_Interface_Top/C (19 pins), U_Intan_Interface_Top/D (19 pins), U_Intan_Interface_Top/E (19 pins), U_Intan_Interface_Top/F (19 pins), U_Intan_Interface_Top/G (19 pins), U_Intan_Interface_Top/H (19 pins)
board_mode_0: FPGA (J1.32 J3.13), Onboard_IO (R2.1 S1.4A)
board_mode_1: FPGA (J1.34 J3.16), Onboard_IO (R3.1 S1.3A)
board_mode_2: FPGA (J1.38 J3.18), Onboard_IO (R4.1 S1.2A)
board_mode_3: FPGA (J1.40 J3.17), Onboard_IO (R5.1 S1.1A)
~{CS}_A: FPGA (J6.16), U_Intan_Interface_Top/A (U1_A.6)
~{CS}_B: FPGA (J6.28), U_Intan_Interface_Top/B (U1_B.6)
~{CS}_C: FPGA (J6.42), U_Intan_Interface_Top/C (U1_C.6)
~{CS}_D: FPGA (J6.54), U_Intan_Interface_Top/D (U1_D.6)
~{CS}_E: FPGA (J6.68), U_Intan_Interface_Top/E (U1_E.6)
~{CS}_F: FPGA (J6.77), U_Intan_Interface_Top/F (U1_F.6)
~{CS}_G: FPGA (J6.65), U_Intan_Interface_Top/G (U1_G.6)
~{CS}_H: FPGA (J6.51), U_Intan_Interface_Top/H (U1_H.6)
MISO_A1: FPGA (J6.24), U_Intan_Interface_Top/A (U2_A.10)
MISO_A2: FPGA (J6.26), U_Intan_Interface_Top/A (U2_A.11)
MISO_B1: FPGA (J6.38), U_Intan_Interface_Top/B (U2_B.10)
MISO_B2: FPGA (J6.40), U_Intan_Interface_Top/B (U2_B.11)
MISO_C1: FPGA (J6.50), U_Intan_Interface_Top/C (U2_C.10)
MISO_C2: FPGA (J6.52), U_Intan_Interface_Top/C (U2_C.11)
MISO_D1: FPGA (J6.64), U_Intan_Interface_Top/D (U2_D.10)
MISO_D2: FPGA (J6.66), U_Intan_Interface_Top/D (U2_D.11)
MISO_E1: FPGA (J6.76), U_Intan_Interface_Top/E (U2_E.10)
MISO_E2: FPGA (J6.79), U_Intan_Interface_Top/E (U2_E.11)
MISO_F1: FPGA (J6.69), U_Intan_Interface_Top/F (U2_F.10)
MISO_F2: FPGA (J6.67), U_Intan_Interface_Top/F (U2_F.11)
MISO_G1: FPGA (J6.57), U_Intan_Interface_Top/G (U2_G.10)
MISO_G2: FPGA (J6.53), U_Intan_Interface_Top/G (U2_G.11)
MISO_H1: FPGA (J6.43), U_Intan_Interface_Top/H (U2_H.10)
MISO_H2: FPGA (J6.41), U_Intan_Interface_Top/H (U2_H.11)
MOSI_A: FPGA (J6.20), U_Intan_Interface_Top/A (U1_A.2)
MOSI_B: FPGA (J6.32), U_Intan_Interface_Top/B (U1_B.2)
MOSI_C: FPGA (J6.46), U_Intan_Interface_Top/C (U1_C.2)
MOSI_D: FPGA (J6.60), U_Intan_Interface_Top/D (U1_D.2)
MOSI_E: FPGA (J6.72), U_Intan_Interface_Top/E (U1_E.2)
MOSI_F: FPGA (J6.73), U_Intan_Interface_Top/F (U1_F.2)
MOSI_G: FPGA (J6.61), U_Intan_Interface_Top/G (U1_G.2)
MOSI_H: FPGA (J6.47), U_Intan_Interface_Top/H (U1_H.2)
REF: Onboard_IO (J5.2), U_Intan_Interface_Top/A (J10_A.B5), U_Intan_Interface_Top/B (J10_B.B5), U_Intan_Interface_Top/C (J10_C.B5), U_Intan_Interface_Top/D (J10_D.B5), U_Intan_Interface_Top/E (J10_E.B5), U_Intan_Interface_Top/F (J10_F.B5), U_Intan_Interface_Top/G (J10_G.B5), U_Intan_Interface_Top/H (J10_H.B5)
SCLK_A: FPGA (J6.18), U_Intan_Interface_Top/A (U1_A.3)
SCLK_B: FPGA (J6.30), U_Intan_Interface_Top/B (U1_B.3)
SCLK_C: FPGA (J6.44), U_Intan_Interface_Top/C (U1_C.3)
SCLK_D: FPGA (J6.58), U_Intan_Interface_Top/D (U1_D.3)
SCLK_E: FPGA (J6.70), U_Intan_Interface_Top/E (U1_E.3)
SCLK_F: FPGA (J6.75), U_Intan_Interface_Top/F (U1_F.3)
SCLK_G: FPGA (J6.63), U_Intan_Interface_Top/G (U1_G.3)
SCLK_H: FPGA (J6.49), U_Intan_Interface_Top/H (U1_H.3)